# EAGLE design neckmed-3 (EAGLE 9.6.2)
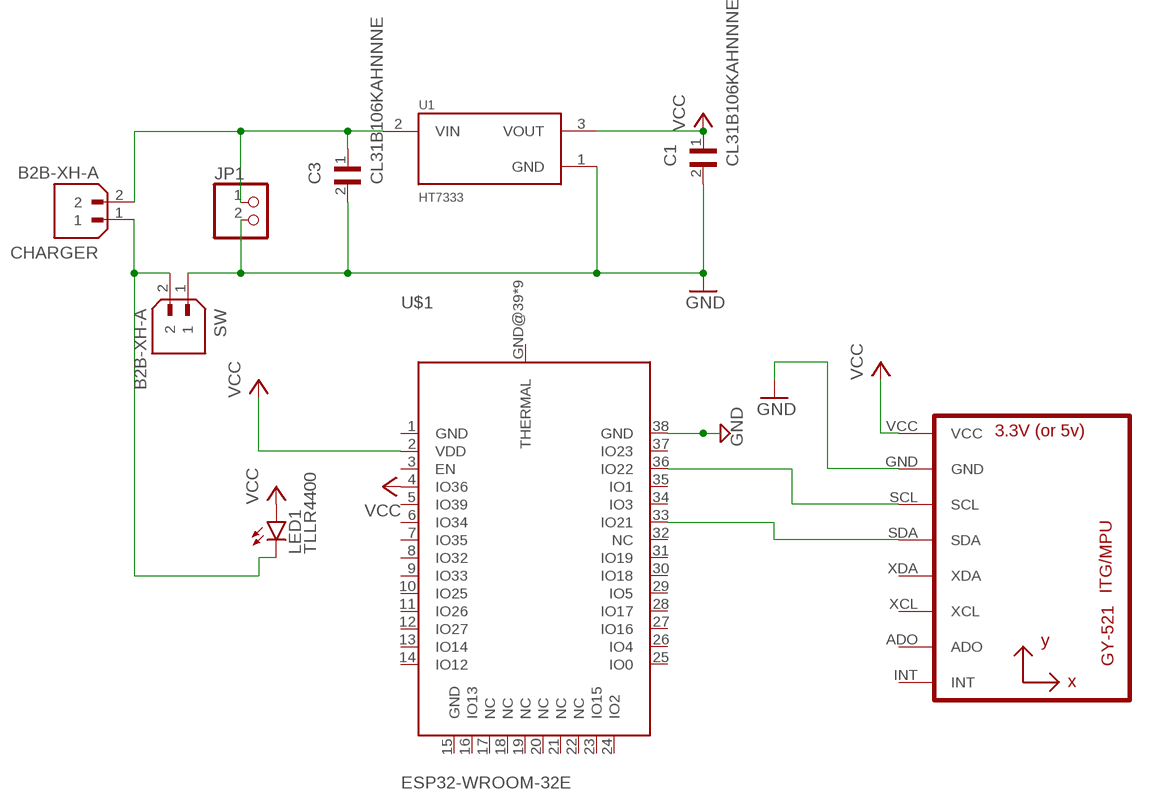
[diagram p0: schematic, sheet 1]

## Parts
C1  CL31B106KAHNNNE  [CAPC3216X180N]
C3  CL31B106KAHNNNE  [CAPC3216X180N]
CHARGER  B2B-XH-A  [JST_B2B-XH-A]
JP1  PINHD-1X2  [1X02]
LED1  TLLR4400  [LED3MM]
SW  B2B-XH-A  [JST_B2B-XH-A]
U1  HT7333  [IC_HT7333]
U2  GY-521MPU6050  [GY-521]
U$1  ESP32-WROOM-32E  [ESP32-WROOM-32E]

## Nets
GND: C1.2 C3.2 JP1.2 SW.1 U1.1(GND) U2.GND U$1.38(GND)
N$1: C3.1 CHARGER.2 JP1.1 U1.2(VIN)
N$2: CHARGER.1 LED1.K(C) SW.2
N$8: U2.SCL U$1.36(IO22)
N$9: U2.SDA U$1.33(IO21)
VCC: C1.1 LED1.A U1.3(VOUT) U2.VCC U$1.2(VDD) U$1.4(IO36)
Unconnected: U2.ADO U2.INT U2.XCL U2.XDA U$1.1(GND) U$1.3(EN) U$1.5(IO39) U$1.6(IO34) U$1.7(IO35) U$1.8(IO32) U$1.9(IO33) U$1.10(IO25) U$1.11(IO26) U$1.12(IO27) U$1.13(IO14) U$1.14(IO12) U$1.15(GND) U$1.16(IO13) U$1.17(NC) U$1.18(NC) U$1.19(NC) U$1.20(NC) U$1.21(NC) U$1.22(NC) U$1.23(IO15) U$1.24(IO2) U$1.25(IO0) U$1.26(IO4) U$1.27(IO16) U$1.28(IO17) U$1.29(IO5) U$1.30(IO18) U$1.31(IO19) U$1.32(NC) U$1.34(IO3) U$1.35(IO1) U$1.37(IO23) U$1.GND@39(THERMAL) U$1.GND@40(THERMAL) U$1.GND@41(THERMAL) U$1.GND@42(THERMAL) U$1.GND@43(THERMAL) U$1.GND@44(THERMAL) U$1.GND@45(THERMAL) U$1.GND@46(THERMAL) U$1.GND@47(THERMAL)

## Library data of the parts
C1 C3 = CL31B106KAHNNNE:CL31B106KAHNNNE: Cap Ceramic 10uF 25V X7R 10% Pad SMD 1206 125°C T/R Check availability <https://pricing.snapeda.com/parts/CL31B106KAHNNNE/Samsung%20Electro-Mechanics/view-part?ref=eda>; AVAILABILITY: In Stock; CHECK_PRICES: https://www.snapeda.com/parts/CL31B106KAHNNNE/Samsung+Electro-Mechanics/view-part/?ref=eda; DESCRIPTION: CL31 Series 10 uF 25 V ±10 % Tolerance X7R SMT Multilayer Ceramic Capacitor; MF: Samsung Electro-Mechanics; MP: CL31B106KAHNNNE; PACKAGE: 1206 Samsung; PRICE: None; PURCHASE-URL: https://www.snapeda.com/api/url_track_click_mouser/?unipart_id=570537&manufacturer=Samsung Electro-Mechanics&part_name=CL31B106KAHNNNE&search_term=capacitor smd 1206 samsung cl31; SNAPEDA_LINK: https://www.snapeda.com/parts/CL31B106KAHNNNE/Samsung+Electro-Mechanics/view-part/?ref=snap
CHARGER SW = B2B-XH-A:B2B-XH-A: Check availability <https://pricing.snapeda.com/parts/B2B-XH-A/JST%20Sales/view-part?ref=eda>; AVAILABILITY: In Stock; CHECK_PRICES: https://www.snapeda.com/parts/B2B-XH-A/JST+Sales+America+Inc./view-part/?ref=eda; DESCRIPTION: Connector Header Through Hole 2 position 0.098 (2.50mm); MF: JST Sales; MP: B2B-XH-A; PACKAGE: None; PRICE: None; PURCHASE-URL: https://www.snapeda.com/api/url_track_click_mouser/?unipart_id=552747&manufacturer=JST Sales&part_name=B2B-XH-A&search_term=b2bxh-a; SNAPEDA_LINK: https://www.snapeda.com/parts/B2B-XH-A/JST+Sales+America+Inc./view-part/?ref=snap
JP1 = pinhead:PINHD-1X2: PIN HEADER
LED1 = led:TLLR4400: Low Current (2mA) LED 3 mm Tinted Diffused Package color RED Source: Data sheet <http://www.farnell.com/datasheets/391100.pdf>; MF: VISHAY SEMICONDUCTOR; OC_FARNELL: 1612437
U1 = HT7333:HT7333: Check availability <https://pricing.snapeda.com/parts/HT7333/Holtek%20Semiconductor/view-part?ref=eda>; AVAILABILITY: Not in stock; CHECK_PRICES: https://www.snapeda.com/parts/HT7333/Holtek/view-part/?ref=eda; DESCRIPTION: Three-terminal, low power, high voltage regulator implemented in CMOS technology; MF: Holtek Semiconductor; MP: HT7333; PACKAGE: None; PRICE: None; SNAPEDA_LINK: https://www.snapeda.com/parts/HT7333/Holtek/view-part/?ref=snap
U2 = GY-521:GY-521: Check availability <https://pricing.snapeda.com/parts/GY-521/GODREAM%20FORDREAM%20CO.%2C%20LIMITED/view-part?ref=eda>; AVAILABILITY: Not in stock; CHECK_PRICES: https://www.snapeda.com/parts/GY-521/GODREAM+FORDREAM+CO.%252C+LIMITED/view-part/?ref=eda; DESCRIPTION: Triple Axis Accelerometer Gyro Breakout; MF: GODREAM FORDREAM CO., LIMITED; MP: GY-521; PACKAGE: Package; PRICE: None; SNAPEDA_LINK: https://www.snapeda.com/parts/GY-521/GODREAM+FORDREAM+CO.%252C+LIMITED/view-part/?ref=snap
U$1 = ESP32-WROOM-32E:ESP32-WROOM-32E: Check availability <https://pricing.snapeda.com/parts/ESP32-WROOM-32E/Espressif%20Systems/view-part?ref=eda>; AVAILABILITY: In Stock; CHECK_PRICES: https://www.snapeda.com/parts/ESP32-WROOM-32E/Espressif+Systems/view-part/?ref=eda; DESCRIPTION: RX TXRX MOD WIFI TRACE ANT SMD; MF: Espressif Systems; MP: ESP32-WROOM-32E; PACKAGE: SMD-44 Espressif Systems; PRICE: None; SNAPEDA_LINK: https://www.snapeda.com/parts/ESP32-WROOM-32E/Espressif+Systems/view-part/?ref=snap

## Board
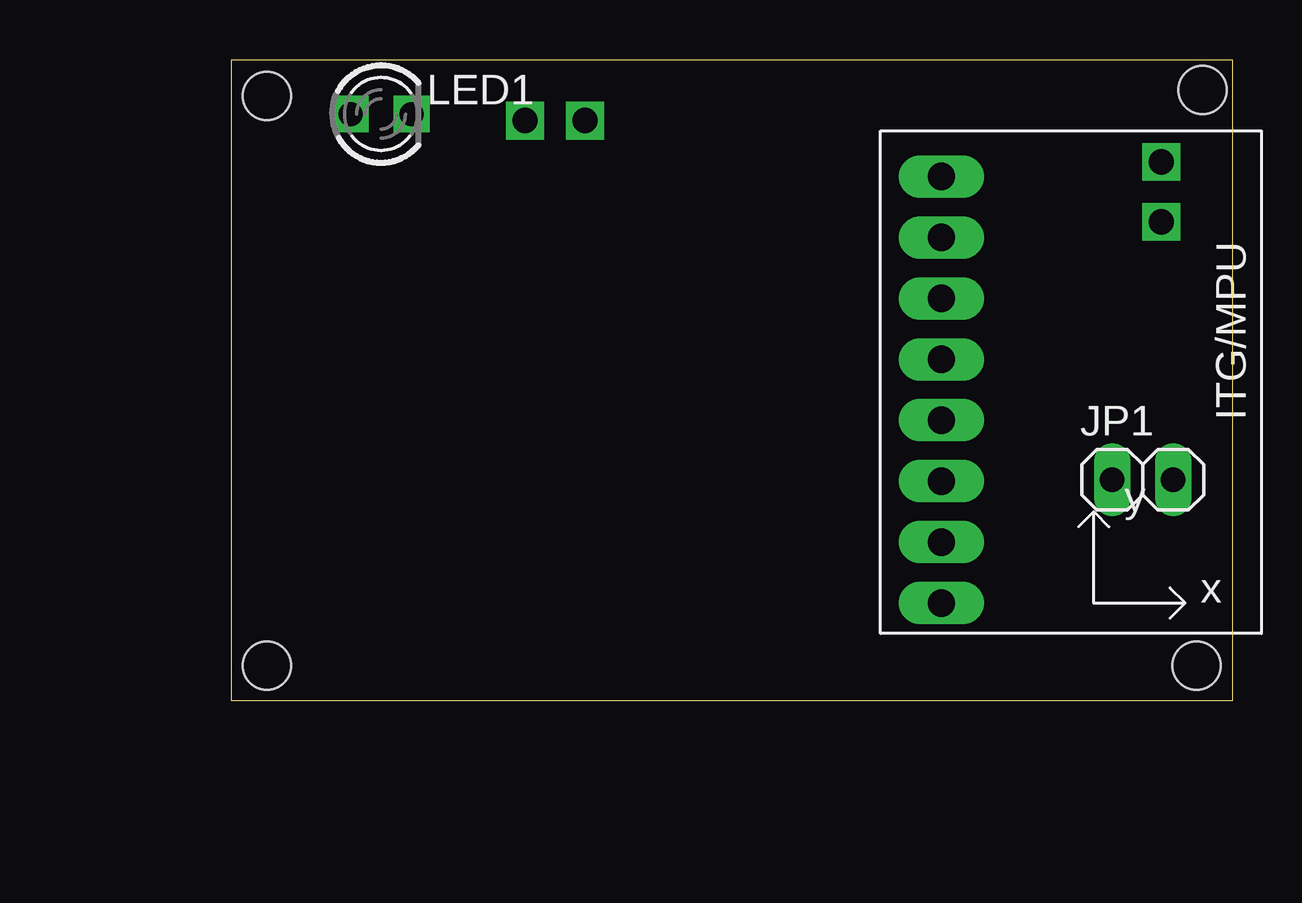
[diagram p1: board, top side]
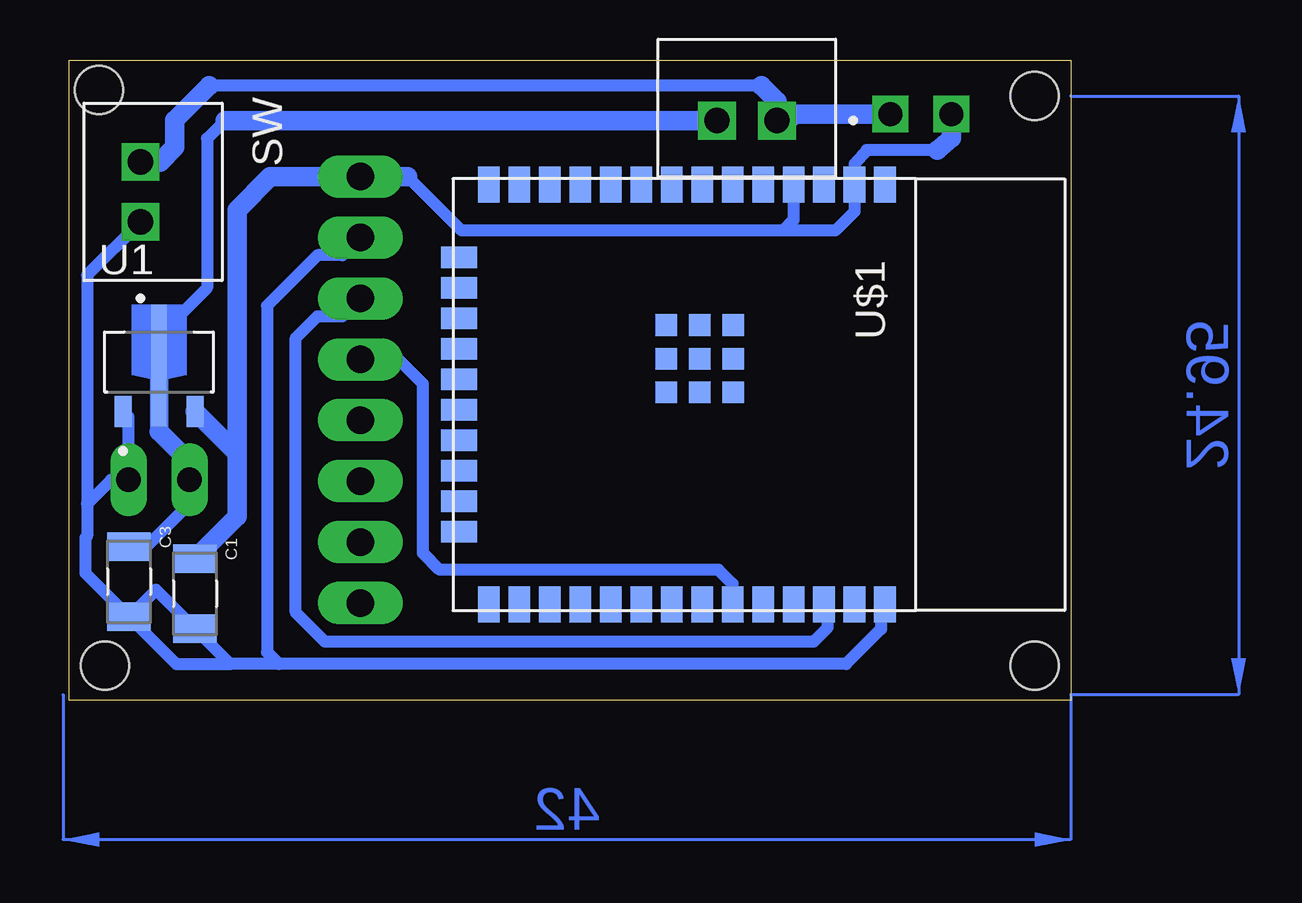
[diagram p2: board, bottom side, seen from below]

Size 41.75 x 26.7 mm. Coordinates in mm from the lower left corner, seen from the top.
Outline: 0,0 41.75,0 41.75,26.7 0,26.7 0,0
Copper layers (1*16): Top 0.035mm / dielectric 1.5mm / Bottom 0.035mm
Design rules "default *": minimum track width 10mil, minimum drill 0.35mm, track to track 16mil, track to pad 16mil, pad to pad 16mil, via to via 16mil, smd to smd 16mil, copper to edge 16mil, drill to drill 16mil, minimum pad ring 10mil, minimum via ring 8mil, stop-mask expansion 4mil, vias tented up to drill 0mil, thermal gap 10mil
Holes 2 mm at 1.5,25.2 40.5,25.45 1.5,1.45 40.25,1.45

### Footprints (pad centres in the part's own frame; a part is rotated, then mirrored left to right if it is on the bottom)
CAPC3216X180N = smd 1.2 x 1.82: 1 -1.46,0; 2 1.46,0
JST_B2B-XH-A = drill 1.05 square: 1 1.25,-0.525; 2 -1.25,-0.525
1X02 = drill 1.016 long: 1 -1.27,0; 2 1.27,0
LED3MM = drill 1 square: A -1.27,0; K 1.27,0
IC_HT7333 = smd 0.7 x 1.3: 1 -1.5,-1.9; 3 1.5,-1.9 | smd 0.66 x 5.08: 2 -0.005,0
GY-521 = drill 1.143 pad 1.778 long: ADO -8.89,-6.35; GND -8.89,6.35; INT -8.89,-8.89; SCL -8.89,3.81; SDA -8.89,1.27; VCC -8.89,8.89; XCL -8.89,-3.81; XDA -8.89,-1.27
ESP32-WROOM-32E = smd 1.5 x 0.9: 1 -8.75,8.255; 2 -8.75,6.985; 3 -8.75,5.715; 4 -8.75,4.445; 5 -8.75,3.175; 6 -8.75,1.905; 7 -8.75,0.635; 8 -8.75,-0.635; 9 -8.75,-1.905; 10 -8.75,-3.175; 11 -8.75,-4.445; 12 -8.75,-5.715; 13 -8.75,-6.985; 14 -8.75,-8.255; 25 8.75,-8.255; 26 8.75,-6.985; 27 8.75,-5.715; 28 8.75,-4.445; 29 8.75,-3.175; 30 8.75,-1.905; 31 8.75,-0.635; 32 8.75,0.635; 33 8.75,1.905; 34 8.75,3.175; 35 8.75,4.445; 36 8.75,5.715; 37 8.75,6.985; 38 8.75,8.255 | smd 0.9 x 1.5: 15 -5.715,-9.505; 16 -4.445,-9.505; 17 -3.175,-9.505; 18 -1.905,-9.505; 19 -0.635,-9.505; 20 0.635,-9.505; 21 1.905,-9.505; 22 3.175,-9.505; 23 4.445,-9.505; 24 5.715,-9.505 | smd 0.9 x 0.9: GND@39 -2.9,1.935; GND@40 -1.5,1.935; GND@41 -0.1,1.935; GND@42 -2.9,0.535; GND@43 -1.5,0.535; GND@44 -0.1,0.535; GND@45 -2.9,-0.865; GND@46 -1.5,-0.865; GND@47 -0.1,-0.865

### Placement (x,y rotation side)
C1  36.5,4.45 270 bottom
C3  39.25,4.95 270 bottom
CHARGER  13.5,24.7 0 bottom
JP1  38,9.2 0 top
LED1  6.25,24.45 0 top
SW  38.25,21.2 270 bottom
U1  38,13.95 0 bottom
U2  38.5,12.95 0 top
U$1  16,12.75 270 bottom

### Tracks (layer width: path | path; a pad name or v marks a point on that pad's centre or on a via)
GND
  Bottom 0.508: 35.03,1.52 37.28,1.52 C3.2 | C3.2 38.12,4.62 C1.2 35.03,1.52 | C3.2 41.07,5.31 41.07,6.78 41,6.85 41,8.2 | 41,8.2 41,17.72 SW.1 | U$1.38 7.91,3.84 7.91,2.98 9.36,1.52 33,1.52 | 33,1.52 35.03,1.52 | U1.1 39.27,11.82 JP1.2 40,9.2 41,8.2 | U2.GND 30.35,18.56 31.39,18.56 33.5,16.45 33.5,2.02 33,1.52
N$1
  Bottom 0.508: C3.1 38.52,6.41 36.75,8.18 | JP1.1 36.75,9.18 | 38.01,11.21 U1.2 38.01,15.19 36,17.2 36,23.43 35.25,24.18
  Bottom 0.813: 36.75,9.18 36.75,8.18 | JP1.1 36.73,9.93 38.01,11.21 | CHARGER.2 35.25,24.18
N$2
  Bottom 0.508: CHARGER.1 12.25,24.97 | 12.9,25.62 35.92,25.62
  Bottom 0.813: 35.92,25.62 37.34,24.2 37.34,23.05 37.95,22.45 SW.2 | 12.25,24.97 12.9,25.62 | CHARGER.1 11.8,24.18 11.53,24.45 LED1.K
N$8
  Bottom 0.508: U$1.36 10.12,3.84 10.12,3.05 10.72,2.45 31.08,2.45 32.3,3.67 32.3,15.11 31.39,16.02 30.35,16.02 U2.SCL
N$9
  Bottom 0.508: U$1.33 14.1,4.86 14.68,5.45 26.3,5.45 27,6.15 27,13.2 28.02,14.22 U2.SDA
VCC
  Bottom 0.508: 12,19.59 9.81,19.59 9.02,20.39 U$1.2 9.02,22.36 8.5,22.95 5.55,22.95 | U$1.4 11.55,20.04 12,19.59 | 12,19.59 25.39,19.59 27.64,21.84
  Bottom 0.813: C1.1 34.75,7.66 34.75,10.3 | U1.3 34.75,10.3 | 5.55,22.95 4.98,23.45 LED1.A | 27.64,21.84 U2.VCC 33.36,21.84 34.75,20.45 34.75,10.3
(copper drawn outside any net)
  shapes: Bottom area x2